# Altium schematic sheet Sheet1.SchDoc
size A
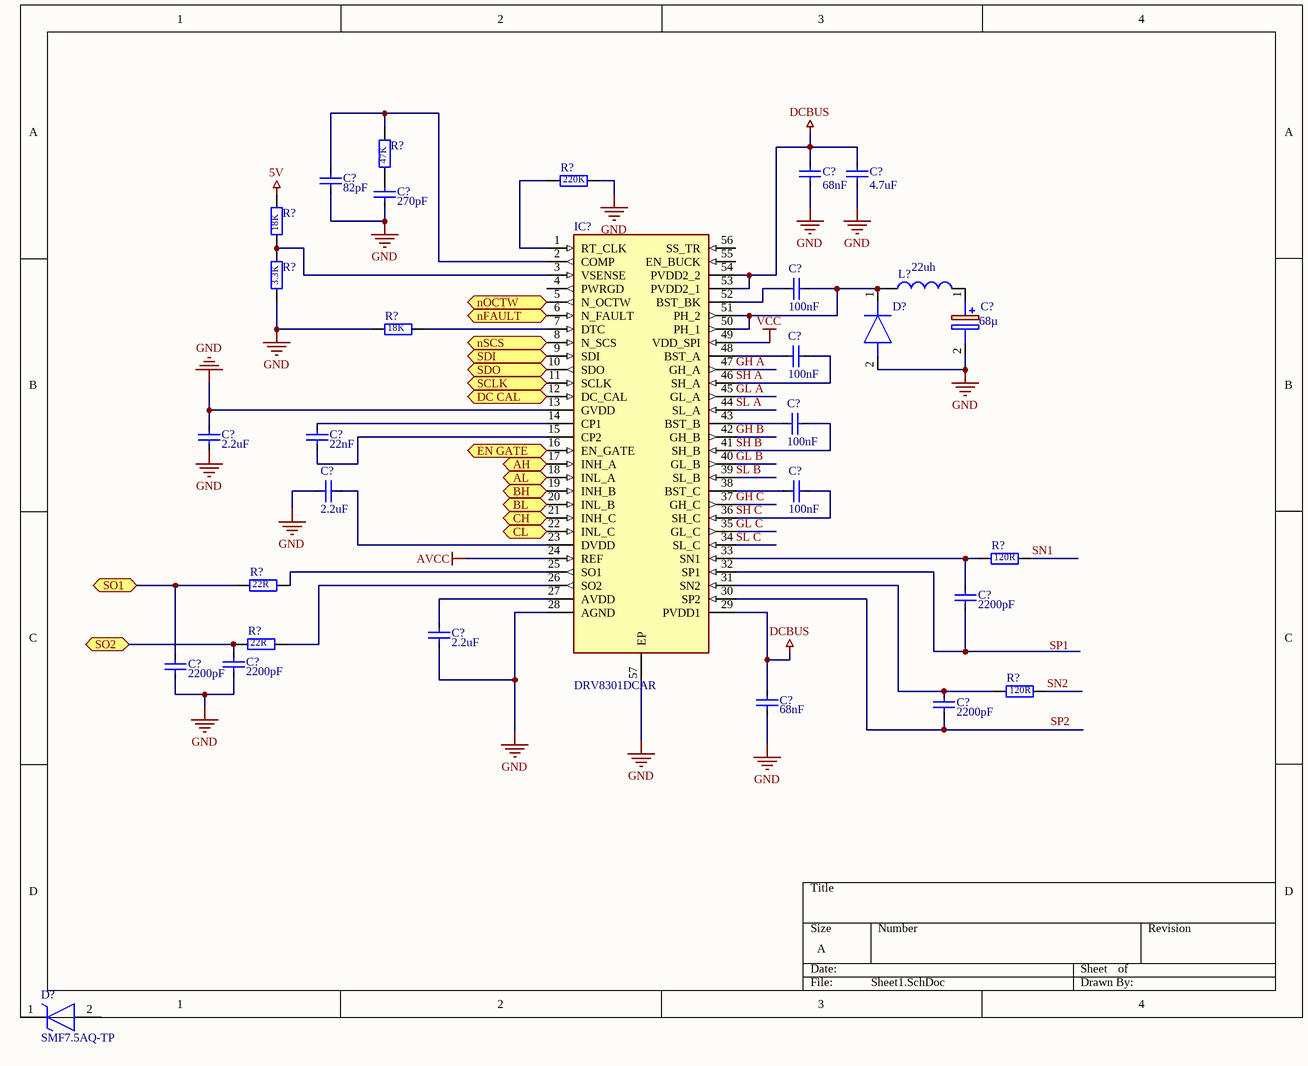
[diagram p0: Sheet1.SchDoc]

## Parts
(Parts that share a designator on the sheet are numbered #1, #2 ... from top to bottom, then left to right.)
C?#1  value 68nF  [CAPC1608X09N]  (hidden comment: C)
C?#2  value 4.7uF  [CAPC1608X09N]  (hidden comment: C)
C?#3  value 82pF  [CAPC1608X09N]  (hidden comment: C)
C?#4  value 270pF  [CAPC1608X09N]  (hidden comment: C)
C?#5  value 100nF  [CAPC1608X09N]  (hidden comment: C)
C?#6  value 68µ  [EEE1AA101SP]  (hidden comment: EEE-FN1E680P)
C?#7  value 100nF  [CAPC1608X09N]  (hidden comment: C)
C?#8  value 100nF  [CAPC1608X09N]  (hidden comment: C)
C?#9  value 2.2uF  [CAPC1608X09N]  (hidden comment: C)
C?#10  value 22nF  [CAPC1608X09N]  (hidden comment: C)
C?#11  value 2.2uF  [CAPC1608X09N]  (hidden comment: C)
C?#12  value 100nF  [CAPC1608X09N]  (hidden comment: C)
C?#13  value 2200pF  [CAPC1608X09N]  (hidden comment: C)
C?#14  value 2.2uF  [CAPC1608X09N]  (hidden comment: C)
C?#15  value 2200pF  [CAPC1608X09N]  (hidden comment: C)
C?#16  value 2200pF  [CAPC1608X09N]  (hidden comment: C)
C?#17  value 68nF  [CAPC1608X09N]  (hidden comment: C)
C?#18  value 2200pF  [CAPC1608X09N]  (hidden comment: C)
D?#1  MBR140SFT3G  [SODFL3616X98N]  (value not drawn)
D?#2  SMF7.5AQ-TP  [SMF75AQTP]
IC?  DRV8301DCAR  [SOP50P810X120-57N]
L?  value 22uh  [INDP6060X57N]  (hidden comment: L)
R?#1  value 47K  [RESC1608X06N]  (hidden comment: R)
R?#2  value 220K  [RESC1608X06N]  (hidden comment: R)
R?#3  value 18K  [RESC1608X06N]  (hidden comment: R)
R?#4  value 3.3K  [RESC1608X06N]  (hidden comment: R)
R?#5  value 18K  [RESC1608X06N]  (hidden comment: R)
R?#6  value 120R  [RESC1608X06N]  (hidden comment: R)
R?#7  value 22R  [RESC1608X06N]  (hidden comment: R)
R?#8  value 22R  [RESC1608X06N]  (hidden comment: R)
R?#9  value 120R  [RESC1608X06N]  (hidden comment: R)

## Ports
AH (bidir), AL (bidir), BH (bidir), BL (bidir), CH (bidir), CL (bidir), DC CAL (bidir), EN GATE (bidir), nFAULT (bidir), nOCTW (bidir), nSCS (bidir), SCLK (bidir), SDI (bidir), SDO (bidir), SO1 (bidir), SO2 (bidir)

## Nets
5V: R?#3.1
DCBUS: C?#1.1 C?#2.1 C?#17.2 IC?.29(PVDD1) IC?.53(PVDD2_1) IC?.54(PVDD2_2)
GND: C?#1.2 C?#2.2 C?#3.1 C?#4.1 C?#6.2(-) C?#9.1 C?#9.2 C?#11.1 C?#14.1 C?#15.1 C?#16.1 C?#17.1 D?#1.2(A) IC?.13(GVDD) IC?.28(AGND) IC?.57(EP) R?#2.2 R?#4.2 R?#5.1
VCC: IC?.49(VDD_SPI)
AH: IC?.17(INH_A) ; port AH
AL: IC?.18(INL_A) ; port AL
BH: IC?.19(INH_B) ; port BH
BL: IC?.20(INL_B) ; port BL
CH: IC?.21(INH_C) ; port CH
CL: IC?.22(INL_C) ; port CL
DC CAL: IC?.12(DC_CAL) ; port DC CAL
EN GATE: IC?.16(EN_GATE) ; port EN GATE
GH A: IC?.47(GH_A)
GH B: IC?.42(GH_B)
GH C: IC?.37(GH_C)
GL A: IC?.45(GL_A)
GL B: IC?.40(GL_B)
GL C: IC?.35(GL_C)
nFAULT: IC?.6(N_FAULT) ; port nFAULT
nOCTW: IC?.5(N_OCTW) ; port nOCTW
nSCS: IC?.8(N_SCS) ; port nSCS
SCLK: IC?.11(SCLK) ; port SCLK
SDI: IC?.9(SDI) ; port SDI
SDO: IC?.10(SDO) ; port SDO
SH A: C?#7.2 IC?.46(SH_A)
SH B: C?#8.2 IC?.41(SH_B)
SH C: C?#12.2 IC?.36(SH_C)
SL A: IC?.44(SL_A)
SL B: IC?.39(SL_B)
SL C: IC?.34(SL_C)
SN1: R?#6.2
SN2: R?#9.2
SO1: C?#15.2 R?#7.1 ; port SO1
SO2: C?#16.2 R?#8.1 ; port SO2
NetC?#3_2: C?#3.2 IC?.2(COMP) R?#1.1
NetC?#4_2: C?#4.2 R?#1.2
NetC?#5_1: C?#5.1 IC?.52(BST_BK)
NetC?#5_2: C?#5.2 D?#1.1(K) IC?.50(PH_1) IC?.51(PH_2) L?.1
NetC?#6_1: C?#6.1(+) L?.2
NetC?#7_1: C?#7.1 IC?.48(BST_A)
NetC?#8_1: C?#8.1 IC?.43(BST_B)
NetC?#10_1: C?#10.1 IC?.15(CP2)
NetC?#10_2: C?#10.2 IC?.14(CP1)
NetC?#11_2: C?#11.2 IC?.23(DVDD)
NetC?#12_1: C?#12.1 IC?.38(BST_C)
NetC?#13_1: C?#13.1 IC?.32(SP1)
NetC?#13_2: C?#13.2 IC?.33(SN1) R?#6.1
NetC?#14_2: C?#14.2 IC?.27(AVDD)
NetC?#18_1: C?#18.1 IC?.30(SP2)
NetC?#18_2: C?#18.2 IC?.31(SN2) R?#9.1
NetIC?_1: IC?.1(RT_CLK) R?#2.1
NetIC?_3: IC?.3(VSENSE) R?#3.2 R?#4.1
NetIC?_7: IC?.7(DTC) R?#5.2
NetIC?_25: IC?.25(SO1) R?#7.2
NetIC?_26: IC?.26(SO2) R?#8.2

Not connected (* = marked no-connect by the designer): D?#2 1(K) 2(A); IC? 4(PWRGD) 24(REF) 55(EN_BUCK) 56(SS_TR)

## Notes on the sheet
- Labels drawn without touching a wire or pin: AVCC, SP1, SP2

## Library data of the parts
C?#1 C?#17 = C: MPN: CC0603KRX7R8BB683; Link: https://www.lcsc.com/product-detail/Multilayer-Ceramic-Capacitors-MLCC-SMD-SMT_YAGEO-CC0603KRX7R8BB683_C107071.html
C?#2 = C: MPN: GRM188C81E475KE11D; Link: https://www.lcsc.com/product-detail/Multilayer-Ceramic-Capacitors-MLCC-SMD-SMT_Murata-Electronics-GRM188C81E475KE11D_C417145.html
C?#3 = C: MPN: CC0603JRNPO9BN820; Link: https://www.lcsc.com/product-detail/Multilayer-Ceramic-Capacitors-MLCC-SMD-SMT_YAGEO-CC0603JRNPO9BN820_C107056.html
C?#4 = C: MPN: 0603B271K500NT; Link: https://www.lcsc.com/product-detail/Multilayer-Ceramic-Capacitors-MLCC-SMD-SMT_YAGEO-CC0603JRNPO9BN271_C107046.html
C?#5 C?#7 C?#8 C?#12 = C: MPN: 06033C104KAT4A; Link: https://www.lcsc.com/product-detail/Multilayer-Ceramic-Capacitors-MLCC-SMD-SMT_Kyocera-AVX-06033C104KAT4A_C2167104.html
C?#6 = EEE-FN1E680P: Capacitor Polarised; Manufacturer_Name: Panasonic; Datasheet Link: http://industrial.panasonic.com/cdbs/www-data/pdf/RDE0000/RDE0000C1259.pdf; Height: 7.8mm; Manufacturer_Part_Number: EEE-FN1E680P; Mouser Part Number: 667-EEE-FN1E680P; Mouser Price/Stock: https://www.mouser.co.uk/ProductDetail/Panasonic/EEE-FN1E680P?qs=OlC7AqGiEDlbbbPxcb4suw%3D%3D; Arrow Part Number: EEE-FN1E680P; Arrow Price/Stock: https://www.arrow.com/en/products/eee-fn1e680p/panasonic
C?#9 C?#11 C?#14 = C: MPN: 0603B225K250NT; Link: https://www.lcsc.com/product-detail/Multilayer-Ceramic-Capacitors-MLCC-SMD-SMT_FH-Guangdong-Fenghua-Advanced-Tech-0603B225K250NT_C99228.html
C?#10 = C: MPN: CC0603KRX7R8BB223; Link: https://www.lcsc.com/product-detail/Multilayer-Ceramic-Capacitors-MLCC-SMD-SMT_YAGEO-CC0603KRX7R8BB223_C106217.html
C?#13 C?#15 C?#16 C?#18 = C: MPN: CC0603KRX7R8BB222; Link: https://www.lcsc.com/product-detail/Multilayer-Ceramic-Capacitors-MLCC-SMD-SMT_YAGEO-CC0603KRX7R8BB222_C519422.html
D?#1 = MBR140SFT3G: Diode; Manufacturer_Name: onsemi; Datasheet Link: https://componentsearchengine.com/Datasheets/2/MBR140SFT3G.pdf; Height: 0.98mm; Manufacturer_Part_Number: MBR140SFT3G; Mouser Part Number: 863-MBR140SFT3G; Mouser Price/Stock: https://www.mouser.co.uk/ProductDetail/onsemi/MBR140SFT3G?qs=3JMERSakebocVlQyvh5H6Q%3D%3D; Arrow Part Number: MBR140SFT3G; Arrow Price/Stock: https://www.arrow.com/en/products/mbr140sft3g/on-semiconductor?region=nac
D?#2 = SMF7.5AQ-TP: TVS Diode (Uni-directional); Manufacturer_Name: MCC; Datasheet Link: https://mccsemi.com/pdf/Products/SMF5.0AQ_SMF100AQ(SOD-123FL).pdf; Height: 1.35mm; Manufacturer_Part_Number: SMF7.5AQ-TP
IC? = DRV8301DCAR: Integrated Circuit; Manufacturer_Name: Texas Instruments; Datasheet Link: http://www.ti.com/lit/gpn/drv8301; Height: 1.2mm; Manufacturer_Part_Number: DRV8301DCAR; Mouser Part Number: 595-DRV8301DCAR; Mouser Price/Stock: https://www.mouser.co.uk/ProductDetail/Texas-Instruments/DRV8301DCAR?qs=SMj%252Bbyv09TwYHebRFanjcw%3D%3D; Arrow Part Number: DRV8301DCAR; Arrow Price/Stock: null?region=nac
L? = L: MPN: XRNR6028-22uH/M; Link: https://www.lcsc.com/product-detail/Power-Inductors_XR-XRNR6028-22uH-M_C5339730.html
R?#1 = R: MPN: FRC0603F4702TS; Link: https://www.lcsc.com/product-detail/Chip-Resistor-Surface-Mount_FOJAN-FRC0603F4702TS_C2907042.html
R?#2 = R: MPN: ARG03FTC2203; Link: https://www.lcsc.com/product-detail/Chip-Resistor-Surface-Mount_Viking-Tech-ARG03FTC2203_C217882.html
R?#3 R?#5 = R: MPN: 0603WAF1802T5E; Link: https://www.lcsc.com/product-detail/Chip-Resistor-Surface-Mount_UNI-ROYAL-Uniroyal-Elec-0603WAF1802T5E_C25810.html
R?#4 = R: MPN: RC0603FR-073K3L; Link: https://www.lcsc.com/product-detail/Chip-Resistor-Surface-Mount_YAGEO-RC0603FR-073K3L_C108078.html
R?#6 R?#9 = R: MPN: ARG03FTC1200; Link: https://www.lcsc.com/product-detail/Chip-Resistor-Surface-Mount_Viking-Tech-ARG03FTC1200_C217712.html
R?#7 R?#8 = R: MPN: ARG03FTC0220; Link: https://www.lcsc.com/product-detail/Chip-Resistor-Surface-Mount_Viking-Tech-ARG03FTC0220_C217888.html